# EAGLE design M212B (EAGLE 6.6.0)
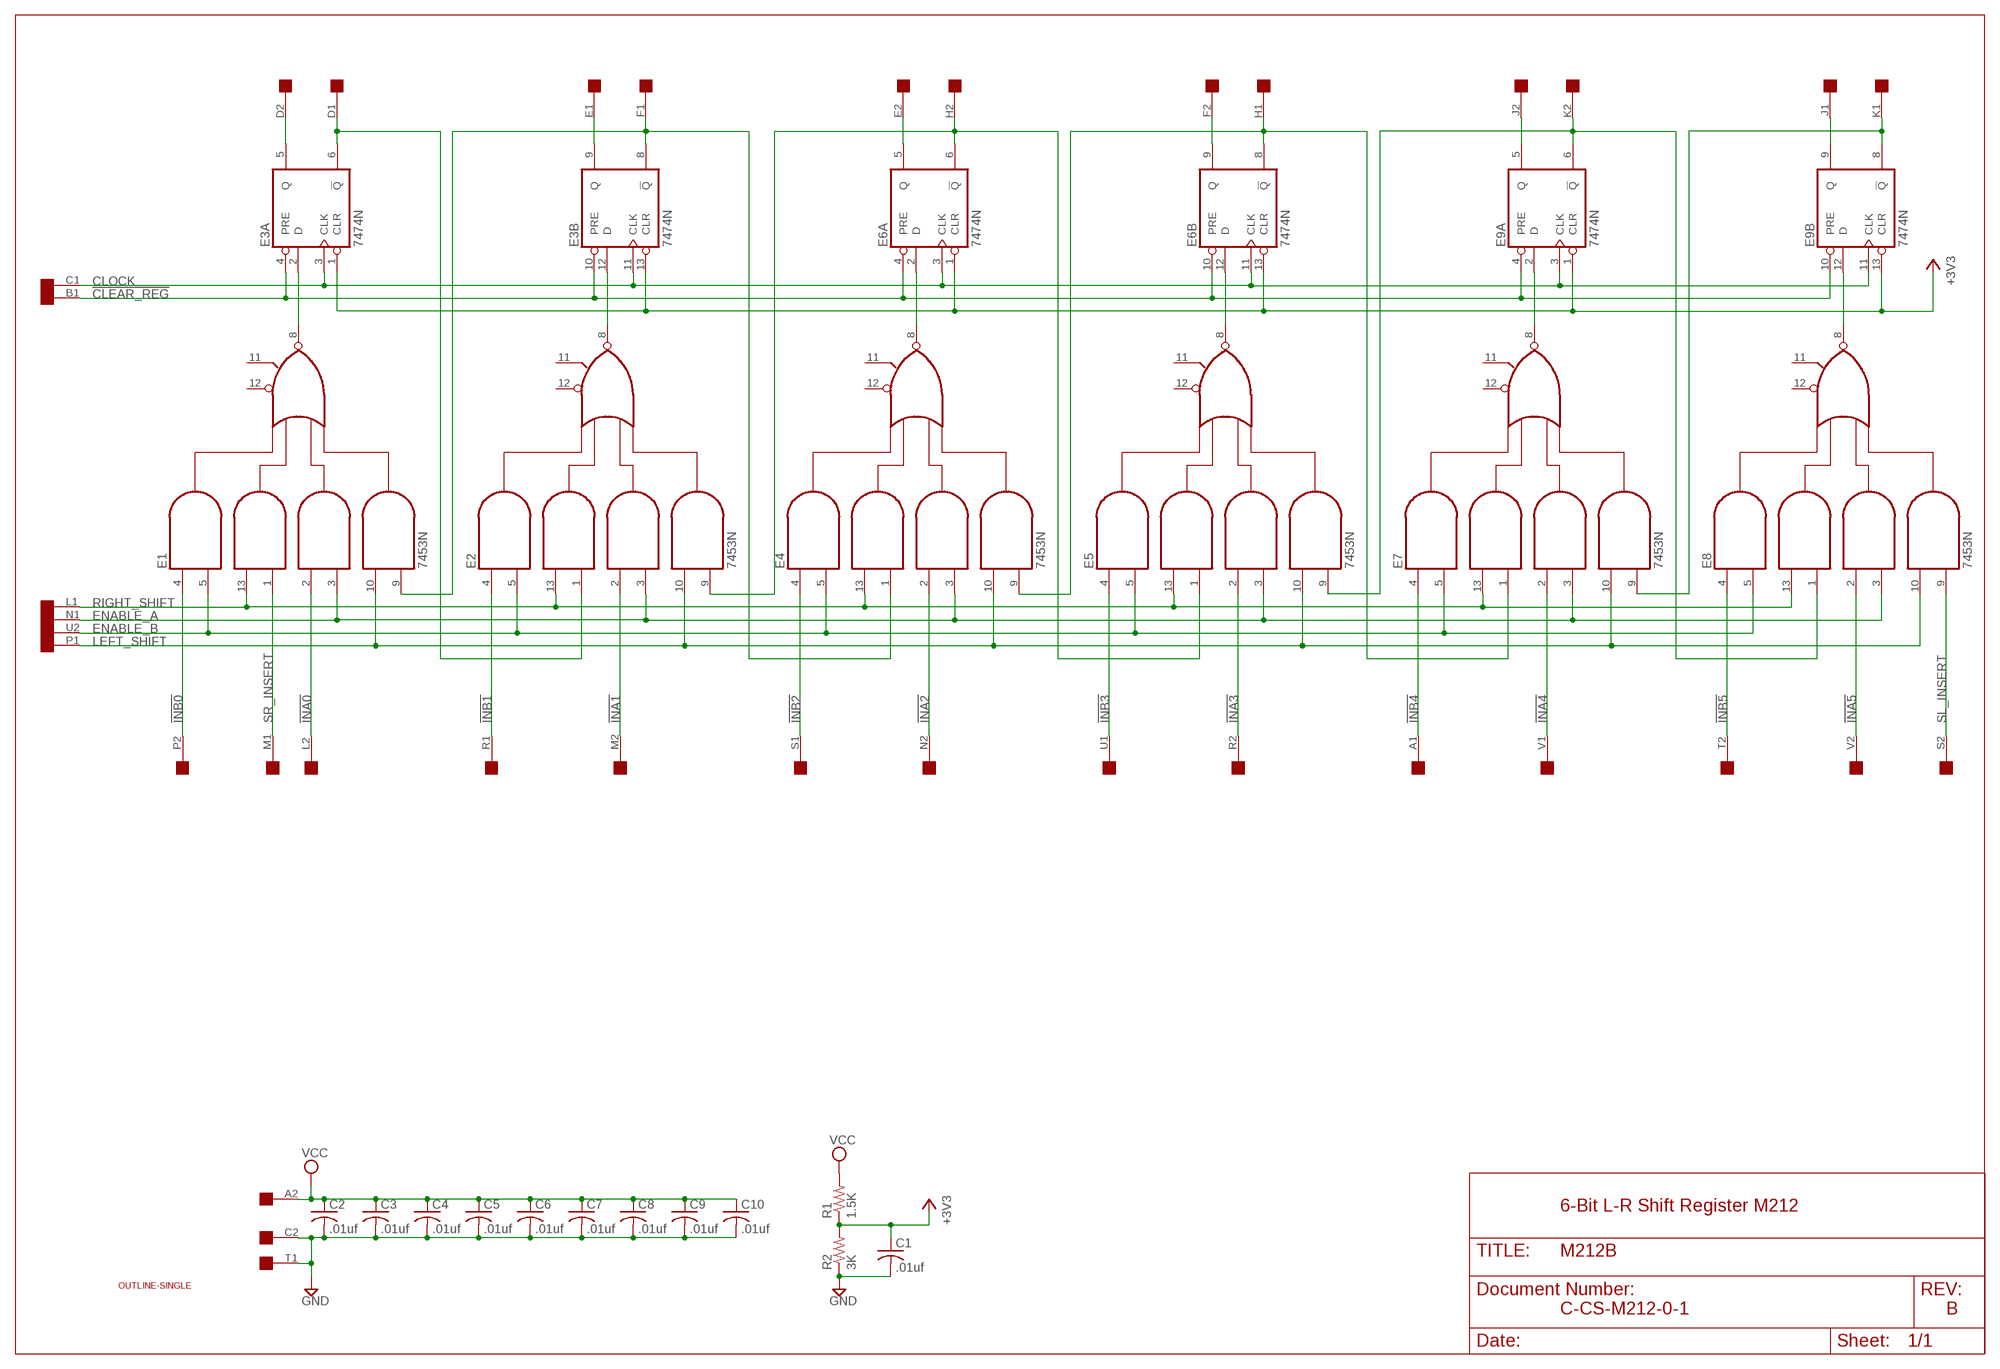
[diagram p0: schematic, sheet 1]

## Parts
C1  .01uf  C-US050-025X075  [C050-025X075]
C2  .01uf  C-US075-032X103  [C075-032X103]
C3  .01uf  C-US075-032X103  [C075-032X103]
C4  .01uf  C-US075-032X103  [C075-032X103]
C5  .01uf  C-US075-032X103  [C075-032X103]
C6  .01uf  C-US075-032X103  [C075-032X103]
C7  .01uf  C-US075-032X103  [C075-032X103]
C8  .01uf  C-US075-032X103  [C075-032X103]
C9  .01uf  C-US075-032X103  [C075-032X103]
C10  .01uf  C-US075-032X103  [C075-032X103]
E1  7453N  [DIL14]
E2  7453N  [DIL14]
E3  7474N  74S74N  [DIL14]
E4  7453N  [DIL14]
E5  7453N  [DIL14]
E6  7474N  74S74N  [DIL14]
E7  7453N  [DIL14]
E8  7453N  [DIL14]
E9  7474N  74S74N  [DIL14]
EDGE1  EDGE-2CONNECTOR  [EDGE-CON2]
R1  1.5K  R-US_0207/10  [0207/10]
R2  3K  R-US_0207/10  [0207/10]
U$1  OUTLINE-SINGLE  [SINGLE]

## Nets
!CLEAR_REG: E3.4(A:PRE) E3.10(B:PRE) E6.4(A:PRE) E6.10(B:PRE) E9.4(A:PRE) E9.10(B:PRE) EDGE1.B1
!INA0: E1.2(I5) EDGE1.L2
!INA1: E2.2(I5) EDGE1.M2
!INA2: E4.2(I5) EDGE1.N2
!INA3: E5.2(I5) EDGE1.R2
!INA4: E7.2(I5) EDGE1.V1
!INA5: E8.2(I5) EDGE1.V2
!INB0: E1.4(I1) EDGE1.P2
!INB1: E2.4(I1) EDGE1.R1
!INB2: E4.4(I1) EDGE1.S1
!INB3: E5.4(I1) EDGE1.U1
!INB4: E7.4(I1) EDGE1.A1
!INB5: E8.4(I1) EDGE1.T2
+3V3: C1.1 E3.1(A:CLR) E3.13(B:CLR) E6.1(A:CLR) E6.13(B:CLR) E9.1(A:CLR) E9.13(B:CLR) R1.1 R2.2
CLOCK: E3.3(A:CLK) E3.11(B:CLK) E6.3(A:CLK) E6.11(B:CLK) E9.3(A:CLK) E9.11(B:CLK) EDGE1.C1
ENABLE_A: E1.3(I6) E2.3(I6) E4.3(I6) E5.3(I6) E7.3(I6) E8.3(I6) EDGE1.N1
ENABLE_B: E1.5(I2) E2.5(I2) E4.5(I2) E5.5(I2) E7.5(I2) E8.5(I2) EDGE1.U2
GND [Supply]: C1.2 C2.2 C3.2 C4.2 C5.2 C6.2 C7.2 C8.2 C9.2 C10.2 EDGE1.C2 EDGE1.T1 R2.1
LEFT_SHIFT: E1.10(I7) E2.10(I7) E4.10(I7) E5.10(I7) E7.10(I7) E8.10(I7) EDGE1.P1
N$1: E1.8(O) E3.2(A:D)
N$2: E2.8(O) E3.12(B:D)
N$3: E4.8(O) E6.2(A:D)
N$4: E5.8(O) E6.12(B:D)
N$5: E7.8(O) E9.2(A:D)
N$6: E8.8(O) E9.12(B:D)
N$7: E3.5(A:Q) EDGE1.D2
N$8: E2.1(I4) E3.6(A:!Q) EDGE1.D1
N$9: E3.9(B:Q) EDGE1.E1
N$10: E1.9(I8) E3.8(B:!Q) E4.1(I4) EDGE1.F1
N$11: E6.5(A:Q) EDGE1.E2
N$12: E2.9(I8) E5.1(I4) E6.6(A:!Q) EDGE1.H2
N$13: E6.9(B:Q) EDGE1.F2
N$14: E4.9(I8) E6.8(B:!Q) E7.1(I4) EDGE1.H1
N$15: E9.5(A:Q) EDGE1.J2
N$16: E5.9(I8) E8.1(I4) E9.6(A:!Q) EDGE1.K2
N$17: E9.9(B:Q) EDGE1.J1
N$18: E7.9(I8) E9.8(B:!Q) EDGE1.K1
RIGHT_SHIFT: E1.13(I3) E2.13(I3) E4.13(I3) E5.13(I3) E7.13(I3) E8.13(I3) EDGE1.L1
SL_INSERT: E8.9(I8) EDGE1.S2
SR_INSERT: E1.1(I4) EDGE1.M1
VCC [Supply]: C2.1 C3.1 C4.1 C5.1 C6.1 C7.1 C8.1 C9.1 C10.1 EDGE1.A2 R1.2
Unconnected: E1.6(SPARE) E1.11(I10) E1.12(I9) E2.6(SPARE) E2.11(I10) E2.12(I9) E4.6(SPARE) E4.11(I10) E4.12(I9) E5.6(SPARE) E5.11(I10) E5.12(I9) E7.6(SPARE) E7.11(I10) E7.12(I9) E8.6(SPARE) E8.11(I10) E8.12(I9) EDGE1.B2

## Notes on the sheet
- 6-Bit L-R Shift Register M212
- C-CS-M212-0-1 | B

## Power pins joined to a net without a drawn wire
GND: E1.7(GND) E2.7(GND) E3.7(P:GND) E4.7(GND) E5.7(GND) E6.7(P:GND) E7.7(GND) E8.7(GND) E9.7(P:GND)
VCC: E1.14(VCC) E2.14(VCC) E3.14(P:VCC) E4.14(VCC) E5.14(VCC) E6.14(P:VCC) E7.14(VCC) E8.14(VCC) E9.14(P:VCC)

## Library data of the parts
C1-C10 = rcl:C-US: CAPACITOR, American symbol
E1 E2 E4 E5 E7 E8 = dec-con:74*53: 4-2-3-2 input AND OR INVERTER gates
E3 E6 E9 = 74xx-us:74*74: Dual D type positive edge triggered FLIP FLOP, preset and clear
EDGE1 = dec-con:EDGE-2: Double-Sided DEC edge connector.
R1 R2 = rcl:R-US_: RESISTOR, American symbol
U$1 = dec-con:OUTLINE-*: Board outlines for DEC boards.

## Net classes
1 Supply: width 0.813 mm

## Board
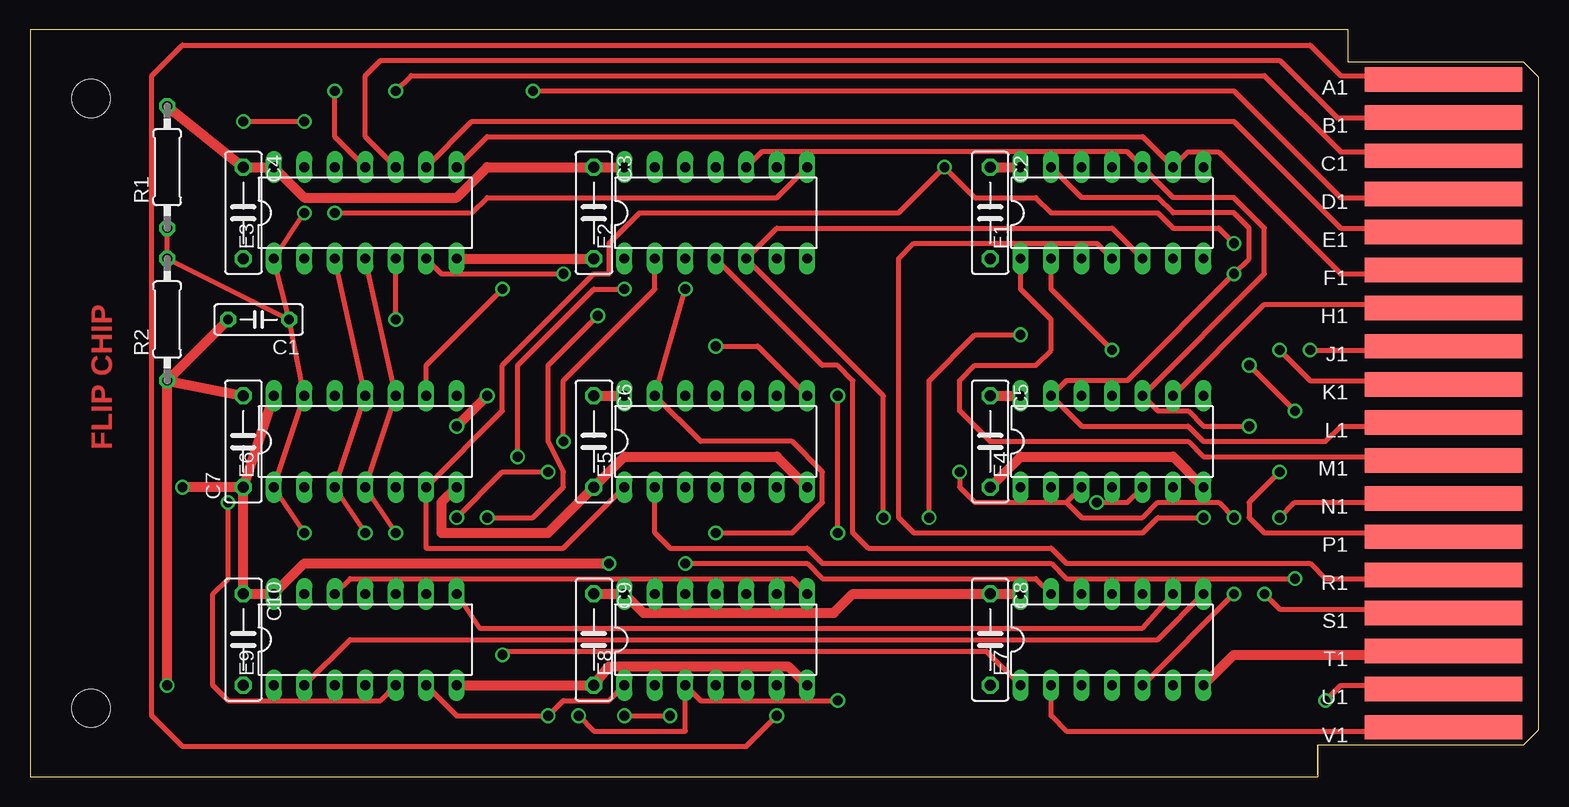
[diagram p1: board, top side]
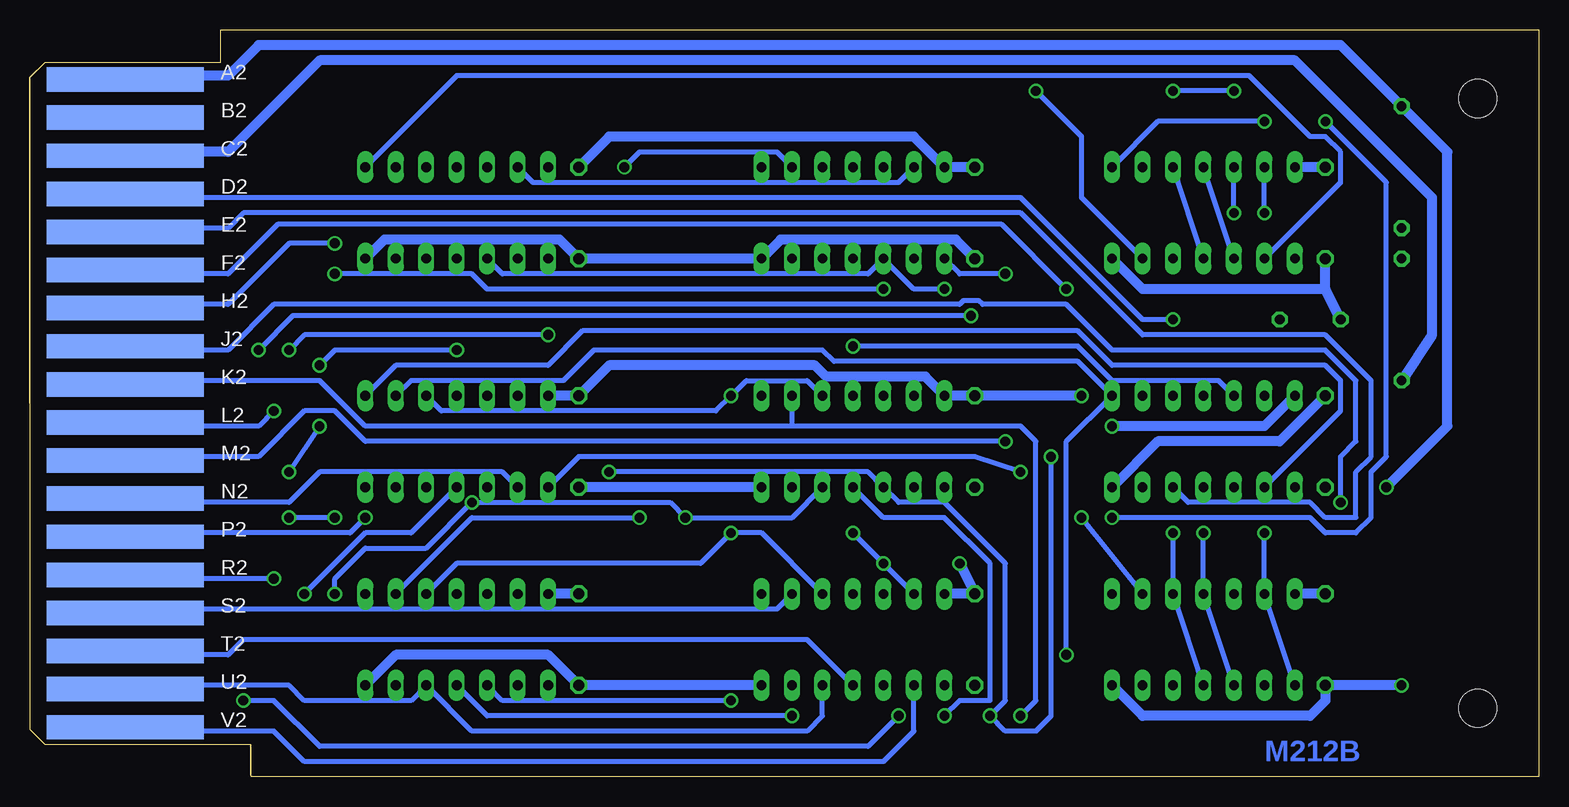
[diagram p2: board, bottom side, seen from below]

Size 125.73 x 62.23 mm. Coordinates in mm from the lower left corner, seen from the top.
Copper layers (1+16): Top 0.035mm / dielectric 1.5mm / Bottom 0.035mm
Design rules "16mils": minimum track width 16mil, minimum drill 32mil, track to track 15mil, track to pad 10mil, pad to pad 10mil, via to via 10mil, smd to smd 10mil, copper to edge 13mil, drill to drill 10mil, minimum pad ring 10mil, minimum via ring 8mil, stop-mask expansion 0mil, vias tented up to drill 0mil, thermal gap 10mil

### Footprints (pad centres in the part's own frame; a part is rotated, then mirrored left to right if it is on the bottom)
C050-025X075 = drill 0.813 octagon: 1 -2.54,0; 2 2.54,0
C075-032X103 = drill 0.914 octagon: 1 -3.81,0; 2 3.81,0
DIL14 = drill 0.813 long: 1 -7.62,-3.81; 2 -5.08,-3.81; 3 -2.54,-3.81; 4 0,-3.81; 5 2.54,-3.81; 6 5.08,-3.81; 7 7.62,-3.81; 8 7.62,3.81; 9 5.08,3.81; 10 2.54,3.81; 11 0,3.81; 12 -2.54,3.81; 13 -5.08,3.81; 14 -7.62,3.81
EDGE-CON2 = smd 13.106 x 2.032: A1 7.938,4.128; B1 7.938,7.303; C1 7.938,10.477; D1 7.938,13.652; E1 7.938,16.828; F1 7.938,20.003; H1 7.938,23.177; J1 7.938,26.352; K1 7.938,29.527; L1 7.938,32.703; M1 7.938,35.877; N1 7.938,39.053; P1 7.938,42.227; R1 7.938,45.403; S1 7.938,48.578; T1 7.938,51.752; U1 7.938,54.928; V1 7.938,58.102 | smd 13.106 x 2.032 bottom: A2 7.938,4.128; B2 7.938,7.303; C2 7.938,10.477; D2 7.938,13.652; E2 7.938,16.828; F2 7.938,20.003; H2 7.938,23.177; J2 7.938,26.352; K2 7.938,29.527; L2 7.938,32.703; M2 7.938,35.877; N2 7.938,39.053; P2 7.938,42.227; R2 7.938,45.403; S2 7.938,48.578; T2 7.938,51.752; U2 7.938,54.928; V2 7.938,58.102
0207/10 = drill 0.813 octagon: 1 -5.08,0; 2 5.08,0
SINGLE = hole 3.175: 120.65,56.515; 120.65,5.715

### Placement (x,y rotation side)
C1  19.05,38.1 180 top
C2  80.01,46.99 270 top
C3  46.99,46.99 270 top
C4  17.78,46.99 270 top
C5  80.01,27.94 270 top
C6  46.99,27.94 270 top
C7  17.78,27.94 90 top
C8  80.01,11.43 270 top
C9  46.99,11.43 270 top
C10  17.78,11.43 270 top
E1  90.17,46.99 0 top
E2  57.15,46.99 0 top
E3  27.94,46.99 0 top
E4  90.17,27.94 0 top
E5  57.15,27.94 0 top
E6  27.94,27.94 0 top
E7  90.17,11.43 0 top
E8  57.15,11.43 0 top
E9  27.94,11.43 0 top
EDGE1  125.73,62.23 180 top
R1  11.43,50.8 90 top
R2  11.43,38.1 90 top
U$1  125.73,62.23 180 top

### Tracks (layer width: path | path; a pad name or v marks a point on that pad's centre or on a via)
!CLEAR_REG  (via drill 0.81 pad 0.81)
  Top 0.406: E3.4 E6.10 E6.4 v30.48,20.32 | EDGE1.B1 108.93,54.9 104.14,59.69 29.21,59.69 27.94,58.42 27.94,53.34 E3.10
  Bottom 0.406: E9.4 E9.10 v30.48,20.32 | E3.4 E3.10
!INA0  (via drill 0.81 pad 0.81)
  Top 0.406: v101.6,34.29 v105.41,30.48 | E1.2 85.09,40.64 v90.17,35.56
  Bottom 0.406: EDGE1.L2 111.76,29.21 106.68,29.21 v105.41,30.48 | v90.17,35.56 100.33,35.56 v101.6,34.29
!INA1  (via drill 0.81 pad 0.81)
  Top 0.406: E2.2 52.07,40.64 44.45,33.02 v44.45,27.94
  Bottom 0.406: EDGE1.M2 112.09,26.34 111.76,26.67 106.68,26.67 102.87,30.48 100.33,30.48 97.79,27.94 v44.45,27.94
!INA2
  Bottom 0.406: EDGE1.N2 112.09,23.19 111.76,22.86 104.14,22.86 101.6,25.4 86.36,25.4 E4.2
!INA3  (via drill 0.81 pad 0.81)
  Top 0.406: v105.41,16.51 86.36,16.51 85.09,17.78 66.04,17.78 64.77,19.05 53.34,19.05 52.07,20.32 E5.2
  Bottom 0.406: EDGE1.R2 112.09,16.84 111.76,16.51 v105.41,16.51
!INA4
  Top 0.406: EDGE1.V1 112.15,4.2 111.76,3.81 86.36,3.81 85.09,5.08 E7.2
!INA5
  Bottom 0.406: EDGE1.V2 112.61,3.81 105.41,3.81 102.87,1.27 54.61,1.27 52.07,3.81 E8.2
!INB0  (via drill 0.81 pad 0.81)
  Top 0.406: v97.79,21.59 93.98,21.59 92.71,20.32 73.66,20.32 72.39,21.59 72.39,43.18 73.66,44.45 88.9,44.45 E1.4
  Bottom 0.406: EDGE1.P2 112.09,19.99 111.76,20.32 99.06,20.32 v97.79,21.59
!INB1
  Top 0.406: E2.4 66.04,34.29 67.31,34.29 68.58,33.02 68.58,20.32 69.85,19.05 85.09,19.05 86.36,17.78 106.68,17.78 107.95,16.51 111.76,16.51 112.09,16.84 EDGE1.R1
!INB2  (via drill 0.81 pad 0.81)
  Top 0.406: EDGE1.S1 112.06,13.66 111.76,13.97 104.14,13.97 v102.87,15.24
  Bottom 0.406: v102.87,15.24 97.79,20.32 93.98,20.32 E4.4
!INB3  (via drill 0.81 pad 0.81)
  Top 0.406: EDGE1.U1 117.73,7.62 109.22,7.62 v107.95,6.35 | v49.53,5.08 v53.34,5.08
  Bottom 0.406: v107.95,6.35 105.41,6.35 101.6,2.54 55.88,2.54 v53.34,5.08 | v49.53,5.08 48.26,6.35 45.72,6.35 45.72,17.78 49.53,21.59 54.61,21.59 E5.4
!INB4  (via drill 0.81 pad 0.81)
  Top 0.406: EDGE1.A1 111.76,58.42 109.22,58.42 106.68,60.96 12.7,60.96 10.16,58.42 10.16,5.08 12.7,2.54 59.69,2.54 v62.23,5.08
  Bottom 0.406: v62.23,5.08 87.63,5.08 E7.4
!INB5
  Bottom 0.406: EDGE1.T2 117.76,10.16 109.22,10.16 107.95,11.43 60.96,11.43 E8.4
+3V3  (via drill 0.81 pad 0.81)
  Top 0.406: R1.1 R2.2 C1.1 | C1.1 E3.1 v22.86,46.99 | C1.1 E6.13 E6.1 v22.86,20.32
  Bottom 0.406: E9.1 E9.13 v22.86,20.32 | v22.86,46.99 E3.13
CLOCK  (via drill 0.81 pad 0.81)
  Top 0.406: E3.3 E6.11 E6.3 v27.94,20.32 | EDGE1.C1 112.09,51.74 111.76,52.07 109.22,52.07 102.87,58.42 31.75,58.42 v30.48,57.15 | v25.4,57.15 25.4,53.34 E3.11
  Bottom 0.406: E9.3 E9.11 v27.94,20.32 | E3.3 E3.11 | v25.4,57.15 v30.48,57.15
ENABLE_A  (via drill 0.81 pad 0.81)
  Top 0.406: v67.31,6.35 55.88,6.35 E8.3 54.61,3.81 46.99,3.81 v45.72,5.08 | v49.53,40.64 46.99,40.64 40.64,34.29 v40.64,26.67 | 86.36,22.86 E4.3 | v77.47,25.4 77.47,24.13 78.74,22.86 86.36,22.86 | v100.33,21.59 99.06,22.86 93.98,22.86 92.71,21.59 87.63,21.59 86.36,22.86 | v104.14,21.59 105.41,22.86 111.76,22.86 112.09,23.19 EDGE1.N1
  Bottom 0.406: E7.3 86.36,6.35 v67.31,6.35 | E1.3 86.36,41.91 55.88,41.91 E2.3 52.07,40.64 v49.53,40.64 | v40.64,26.67 40.64,5.08 41.91,3.81 44.45,3.81 v45.72,5.08 44.45,6.35 44.45,17.78 49.53,22.86 53.34,22.86 E5.3 55.88,25.4 v77.47,25.4 | v100.33,21.59 v104.14,21.59
ENABLE_B  (via drill 0.81 pad 0.81)
  Top 0.406: E7.5 v100.33,15.24 | E4.5 91.44,22.86 v88.9,22.86 | v71.12,21.59 71.12,31.75 E2.5 62.23,45.72 90.17,45.72 E1.5
  Bottom 0.406: v100.33,15.24 100.33,16.51 97.79,19.05 92.71,19.05 v88.9,22.86 72.39,22.86 v71.12,21.59 62.23,21.59 E5.5 | EDGE1.U2 117.73,7.62 104.14,7.62 102.87,6.35 93.98,6.35 E7.5 88.9,3.81 60.96,3.81 59.69,5.08 E8.5
GND  (via drill 0.81 pad 0.81)
  Top 0.813: EDGE1.T1 112.09,10.49 111.76,10.16 100.33,10.16 E7.7 | E8.7 63.18,9.21 48.26,9.21 C9.2 E9.7 | v11.43,7.62 R2.1 | R2.1 C7.2 | R2.1 C1.2 | E5.7 62.23,26.67 49.53,26.67 C6.2 43.18,20.32 34.29,20.32 34.29,22.86 E6.7 | C5.2 82.55,26.67 95.25,26.67 E4.7 | E3.7 C3.2
  Bottom 0.813: EDGE1.C2 111.76,52.07 109.22,52.07 101.6,59.69 20.32,59.69 8.89,48.26 8.89,36.83 R2.1 | E7.7 95.25,10.16 82.55,10.16 C8.2 E8.7 | E9.7 33.02,5.08 19.05,5.08 17.78,6.35 C10.2 v11.43,7.62 | E5.7 C5.2 | E6.7 31.75,27.94 21.59,27.94 C7.2 | 17.78,40.64 C4.2 | E3.7 33.02,40.64 17.78,40.64 | C1.2 17.78,40.64 | C3.2 48.58,44.77 63.18,44.77 E2.7 C2.2 81.6,44.77 96.2,44.77 E1.7
LEFT_SHIFT  (via drill 0.81 pad 0.81)
  Top 0.406: E2.10 60.96,52.07 91.44,52.07 E1.10 95.25,48.26 100.33,48.26 102.87,45.72 102.87,41.91 E4.10 93.98,30.48 96.52,30.48 97.79,29.21 v101.6,29.21 | v67.31,20.32 v67.31,31.75 | EDGE1.P1 112.09,19.99 111.76,20.32 102.87,20.32 101.6,21.59 101.6,22.86 v104.14,25.4
  Bottom 0.406: E5.10 60.96,33.02 66.04,33.02 v67.31,31.75 68.58,30.48 91.44,30.48 E4.10 | E7.10 90.17,17.78 69.85,17.78 v67.31,20.32 64.77,20.32 E8.10 | v101.6,29.21 v104.14,25.4
N$1
  Bottom 0.406: E1.8 90.17,58.42 24.13,58.42 19.05,53.34 17.78,53.34 16.51,52.07 16.51,49.53 E3.2
N$2  (via drill 0.81 pad 0.81)
  Top 0.406: v25.4,46.99 36.83,46.99 38.1,48.26 62.23,48.26 E2.8
  Bottom 0.406: v25.4,46.99 E3.12
N$3
  Bottom 0.406: E6.2 16.51,30.48 16.51,33.02 17.78,34.29 35.56,34.29 38.42,37.15 79.69,37.15 82.55,34.29 95.25,34.29 E4.8
N$4  (via drill 0.81 pad 0.81)
  Top 0.406: v57.15,35.88 60.64,35.88 E5.8
  Bottom 0.406: E6.12 26.67,33.02 35.56,33.02 38.42,35.88 v57.15,35.88
N$5
  Top 0.406: E7.8 93.98,11.43 26.67,11.43 E9.2
N$6
  Top 0.406: E9.12 26.67,16.51 63.5,16.51 E8.8
N$7  (via drill 0.81 pad 0.81)
  Top 0.406: v30.48,38.1 E3.5
  Bottom 0.406: EDGE1.D2 112.06,48.56 111.76,48.26 43.18,48.26 33.02,38.1 v30.48,38.1
N$8  (via drill 0.81 pad 0.81)
  Top 0.406: EDGE1.D1 112.06,48.56 111.76,48.26 109.22,48.26 100.33,57.15 v41.91,57.15 | E3.6 34.29,41.91 v44.45,41.91
  Bottom 0.406: E3.6 38.1,48.26 38.1,53.34 v41.91,57.15 | v44.45,41.91 48.26,41.91 E2.1
N$9
  Top 0.406: EDGE1.E1 112.09,45.39 111.76,45.72 109.22,45.72 100.33,54.61 36.83,54.61 E3.9
N$10  (via drill 0.81 pad 0.81)
  Top 0.406: EDGE1.F1 112.04,42.19 111.76,41.91 109.22,41.91 99.06,52.07 96.52,52.07 E1.9 92.71,53.34 38.1,53.34 E3.8 | v43.18,25.4 39.37,25.4 v35.56,21.59 | v17.78,54.61 v22.86,54.61
  Bottom 0.406: E4.1 80.01,26.67 46.99,26.67 v43.18,25.4 | v35.56,21.59 19.05,21.59 17.78,20.32 15.24,20.32 13.97,21.59 13.97,25.4 12.7,26.67 12.7,49.53 v17.78,54.61 | E3.8 31.75,54.61 v22.86,54.61
N$11
  Bottom 0.406: EDGE1.E2 112.09,45.39 111.76,45.72 109.22,45.72 107.95,46.99 43.18,46.99 33.02,36.83 17.78,36.83 13.97,33.02 13.97,26.67 15.24,25.4 15.24,21.59 17.78,21.59 19.05,22.86 29.21,22.86 E6.5
N$12  (via drill 0.81 pad 0.81)
  Top 0.406: E5.1 44.45,19.05 33.02,19.05 E6.6 39.37,30.48 39.37,34.29 46.99,41.91 48.26,41.91 48.26,44.45 50.8,46.99 72.39,46.99 v76.2,50.8 78.74,48.26 83.82,48.26 85.09,46.99 93.98,46.99 95.25,45.72 99.06,45.72 v100.33,44.45
  Bottom 0.406: E2.9 63.5,52.07 74.93,52.07 v76.2,50.8 | EDGE1.H2 112.09,39.04 111.76,39.37 109.22,39.37 104.14,44.45 v100.33,44.45
N$13  (via drill 0.81 pad 0.81)
  Top 0.406: E6.9 33.02,34.29 v39.37,40.64
  Bottom 0.406: EDGE1.F2 112.04,42.19 111.76,41.91 109.22,41.91 105.09,46.04 44.77,46.04 v39.37,40.64
N$14  (via drill 0.81 pad 0.81)
  Top 0.406: EDGE1.H1 112.09,39.04 111.76,39.37 102.87,39.37 E4.9 | E7.1 79.69,10.48 39.69,10.48 v39.37,10.16
  Bottom 0.406: v39.37,10.16 39.37,27.94 E6.8 38.42,34.61 58.74,34.61 59.69,35.56 78.74,35.56 81.28,33.02 93.98,33.02 E4.9
N$15  (via drill 0.81 pad 0.81)
  Top 0.406: E9.5 29.21,6.35 16.51,6.35 15.24,7.62 15.24,15.24 16.51,16.51 v16.51,22.86
  Bottom 0.406: v16.51,22.86 16.51,26.67 15.24,27.94 15.24,33.02 17.78,35.56 35.56,35.56 39.37,39.37 46.35,39.37 46.67,39.69 47.94,39.69 48.26,39.37 105.41,39.37 109.22,35.56 111.76,35.56 112.09,35.89 EDGE1.J2
N$16  (via drill 0.81 pad 0.81)
  Top 0.406: E8.1 48.26,6.35 44.45,6.35 v43.18,5.08 35.56,5.08 E9.6
  Bottom 0.406: 62.23,29.21 E5.9 | 62.23,29.21 43.18,29.21 41.91,27.94 41.91,6.35 v43.18,5.08 | EDGE1.K2 112.06,32.72 111.76,33.02 101.6,33.02 97.79,29.21 62.23,29.21
N$17  (via drill 0.81 pad 0.81)
  Top 0.406: EDGE1.J1 112.09,35.89 111.76,35.56 v106.68,35.56 | v38.1,21.59 41.91,21.59 44.45,24.13 44.45,25.4 43.18,27.94 43.18,34.29 v47.31,38.42
  Bottom 0.406: E9.9 v38.1,21.59 | v106.68,35.56 103.82,38.42 v47.31,38.42
N$18  (via drill 0.81 pad 0.81)
  Top 0.406: E9.8 37.47,12.38 92.71,12.38 E7.9 | EDGE1.K1 112.06,32.72 111.76,33.02 106.68,33.02 v104.14,35.56 | v82.55,36.83 78.74,36.83 74.93,33.02 v74.93,21.59
  Bottom 0.406: v104.14,35.56 102.87,36.83 v82.55,36.83 | v74.93,21.59 88.9,21.59 E7.9
RIGHT_SHIFT  (via drill 0.81 pad 0.81)
  Top 0.406: E1.13 87.63,48.26 93.98,48.26 95.25,46.99 100.33,46.99 101.6,45.72 101.6,43.18 v100.33,41.91 91.44,33.02 86.36,33.02 E4.13 87.63,29.21 96.52,29.21 97.79,27.94 107.95,27.94 109.22,29.21 111.76,29.21 112.09,29.54 EDGE1.L1 | E7.13 83.82,16.51 66.04,16.51 64.77,17.78 v54.61,17.78 | v54.61,40.64 E5.13 55.88,27.94 63.5,27.94 66.04,25.4 66.04,22.86 63.5,20.32 v57.15,20.32
  Bottom 0.406: E1.13 83.82,49.53 53.34,49.53 E2.13 | v54.61,40.64 87.63,40.64 88.9,41.91 v100.33,41.91 | E8.13 v54.61,17.78 v57.15,20.32
SL_INSERT
  Bottom 0.406: EDGE1.S2 117.78,13.97 63.5,13.97 E8.9
SR_INSERT
  Top 0.406: E1.1 82.55,40.64 85.09,38.1 85.09,35.56 83.82,34.29 78.74,34.29 77.47,33.02 77.47,30.48 80.01,27.94 96.52,27.94 97.79,26.67 111.76,26.67 112.09,26.34 EDGE1.M1
VCC  (via drill 0.81 pad 0.81)
  Top 0.813: R1.2 C4.1 E3.14 22.86,48.26 35.56,48.26 38.1,50.8 C3.1 E2.14 | C2.1 E1.14 | E7.14 C8.1 68.58,15.24 66.99,13.65 51.12,13.65 E8.14 C9.1 | C5.1 E4.14 | C6.1 E5.14 | C7.1 E6.14 | v48.26,17.78 22.86,17.78 E9.14 C10.1 C7.1 | v35.56,29.21 v38.1,31.75 | C7.1 v12.7,24.13
  Bottom 0.813: EDGE1.A2 113.03,58.02 111.76,58.42 109.22,58.42 106.68,60.96 16.51,60.96 R1.2 7.62,52.07 7.62,29.21 v12.7,24.13 | C4.1 E3.14 | C3.1 E2.14 52.07,53.34 77.47,53.34 C2.1 | E8.14 C9.1 v48.26,17.78 | E4.14 C5.1 77.47,34.29 60.33,34.29 59.37,33.34 51.12,33.34 E5.14 C6.1 v38.1,31.75 | C8.1 E7.14 | C10.1 E9.14 | v35.56,29.21 22.86,29.21 E6.14

### Text on the board
Top: FLIP CHIP
Bottom: M212B